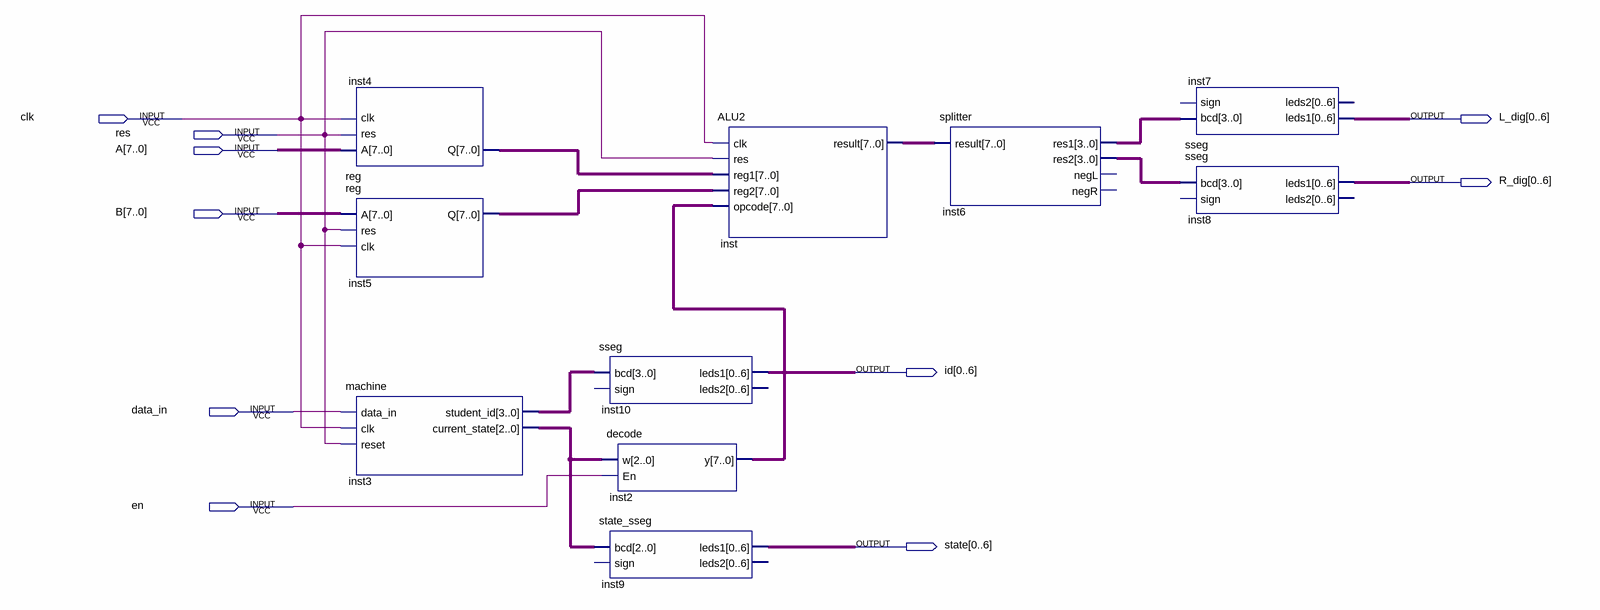
[diagram p0: schematic sheet]
// Quartus schematic CPU_design2.bdf as structural Verilog: 10 symbols, 10 pins
module CPU_design2 (
  input  clk,
  input  res,
  input  [7:0] A,
  input  [7:0] B,
  input  data_in,
  input  en,
  output [0:6] L_dig,
  output [0:6] R_dig,
  output [0:6] id,
  output [0:6] state
);

  wire [2:0] inst3_current_state;
  wire [3:0] inst3_student_id, inst6_res1, inst6_res2;
  wire [7:0] inst2_y, inst4_q, inst5_q, inst_result;

  \reg  inst4 (.A(A), .res(res), .clk(clk), .Q(inst4_q));
  \reg  inst5 (.A(B), .res(res), .clk(clk), .Q(inst5_q));
  machine inst3 (
    .data_in(data_in), .clk(clk), .reset(res), .student_id(inst3_student_id),
    .current_state(inst3_current_state));
  sseg inst10 (.bcd(inst3_student_id), .leds1(id));  // open: sign, leds2
  decode inst2 (.w(inst3_current_state), .En(en), .y(inst2_y));
  state_sseg inst9 (.bcd(inst3_current_state), .leds1(state));  // open: sign, leds2
  ALU2 inst (.clk(clk), .res(res), .reg1(inst4_q), .reg2(inst5_q), .opcode(inst2_y), .result(inst_result));
  splitter inst6 (.result(inst_result), .res1(inst6_res1), .res2(inst6_res2));  // open: negL, negR
  sseg inst7 (.bcd(inst6_res1), .leds1(L_dig));  // open: sign, leds2
  sseg inst8 (.bcd(inst6_res2), .leds1(R_dig));  // open: sign, leds2
endmodule
